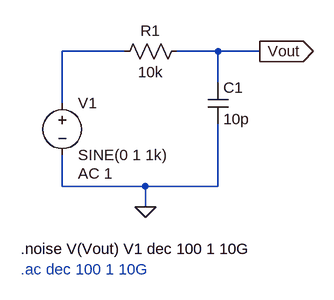
[diagram p0: schematic Q1.asc]
Q1.asc, the LTspice schematic file:
Version 4.1
SHEET 1 880 680
WIRE 144 32 48 32
WIRE 288 32 224 32
WIRE 352 32 288 32
WIRE 288 80 288 32
WIRE 48 112 48 32
WIRE 48 240 48 192
WIRE 176 240 48 240
WIRE 288 240 288 144
WIRE 288 240 176 240
WIRE 176 272 176 240
FLAG 352 32 Vout
IOPIN 352 32 Out
FLAG 176 272 0
SYMBOL voltage 48 96 R0
WINDOW 123 24 124 Left 2
WINDOW 39 0 0 Left 0
SYMATTR InstName V1
SYMATTR Value SINE(0 1 1k)
SYMATTR Value2 AC 1
SYMBOL res 240 16 R90
WINDOW 0 0 56 VBottom 2
WINDOW 3 32 56 VTop 2
SYMATTR InstName R1
SYMATTR Value 10k
SYMBOL cap 272 80 R0
SYMATTR InstName C1
SYMATTR Value 10p
TEXT -16 336 Left 2 !.noise V(Vout) V1 dec 100 1 10G
TEXT -16 368 Left 2 ;.ac dec 100 1 10G

The netlist it stands for:
* Q1.asc
V1 N001 0 SINE(0 1 1k) AC 1
R1 Vout N001 10k
C1 Vout 0 10p
.noise V(Vout) V1 dec 100 1 10G
* .ac dec 100 1 10G
.backanno
.end